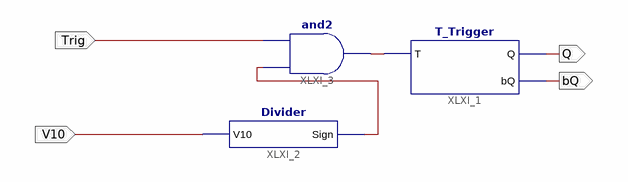
[diagram p0: schematic sheet 1]
// Xilinx ISE schematic Scheme.sch (spartan6) as structural Verilog: 3 symbols, 4 ports
module Scheme (
  input  Trig,
  input  V10,
  output Q,
  output bQ
);

  wire XLXN_4, XLXN_5;

  T_Trigger XLXI_1 (.T(XLXN_4), .Q(Q), .bQ(bQ));
  Divider XLXI_2 (.V10(V10), .Sign(XLXN_5));
  and XLXI_3 (XLXN_4, XLXN_5, Trig);
endmodule
